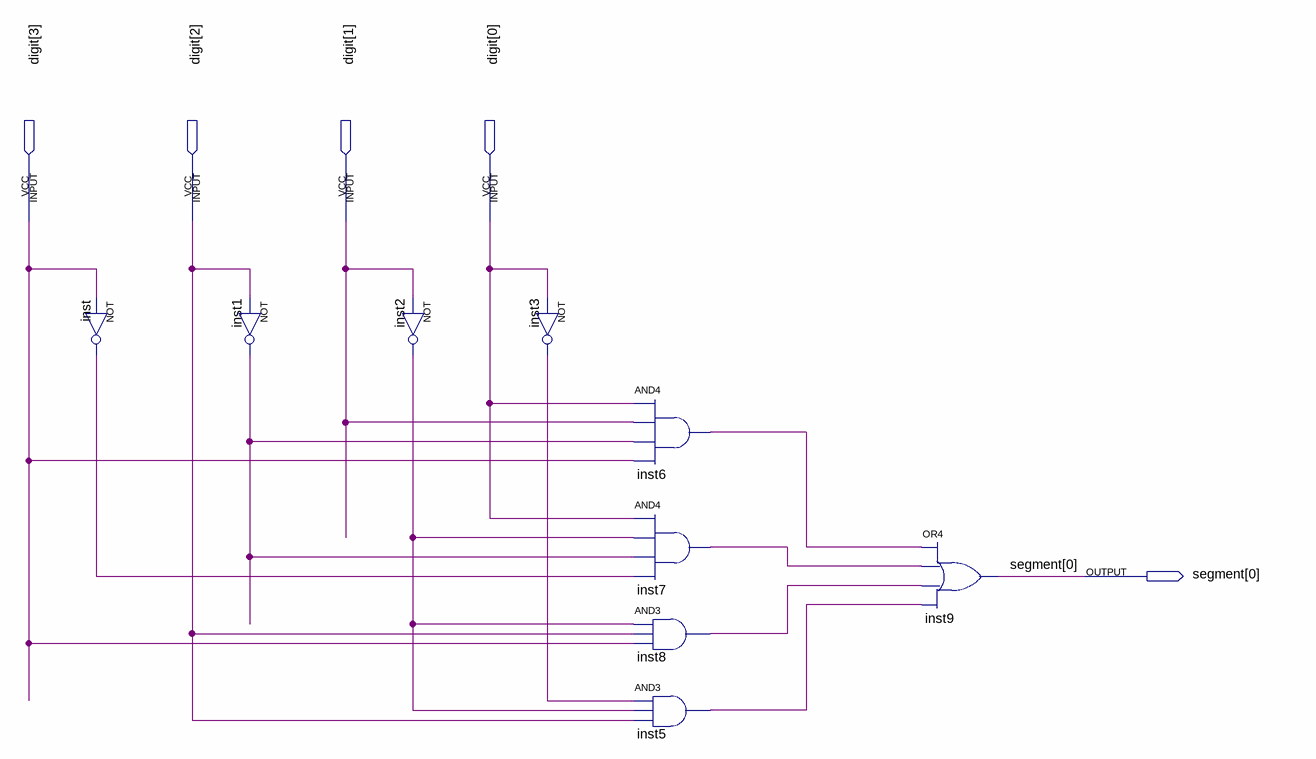
[diagram p0: schematic sheet]
// Quartus schematic segmentA.bdf as structural Verilog: 9 symbols, 5 pins
module segmentA (
  input  [3:0] digit,
  output [0:0] segment
);

  wire inst1_out, inst2_out, inst3_out, inst5_out, inst6_out, inst7_out, inst8_out, inst_out;

  not inst (inst_out, digit[3]);
  not inst1 (inst1_out, digit[2]);
  not inst2 (inst2_out, digit[1]);
  not inst3 (inst3_out, digit[0]);
  and inst6 (inst6_out, digit[0], digit[1], inst1_out, digit[3]);
  and inst7 (inst7_out, digit[0], inst2_out, inst1_out, inst_out);
  and inst8 (inst8_out, inst2_out, digit[2], digit[3]);
  and inst5 (inst5_out, inst3_out, inst2_out, digit[2]);
  or inst9 (segment[0], inst6_out, inst7_out, inst8_out, inst5_out);
endmodule
